# Altium schematic sheet power.SchDoc
size A
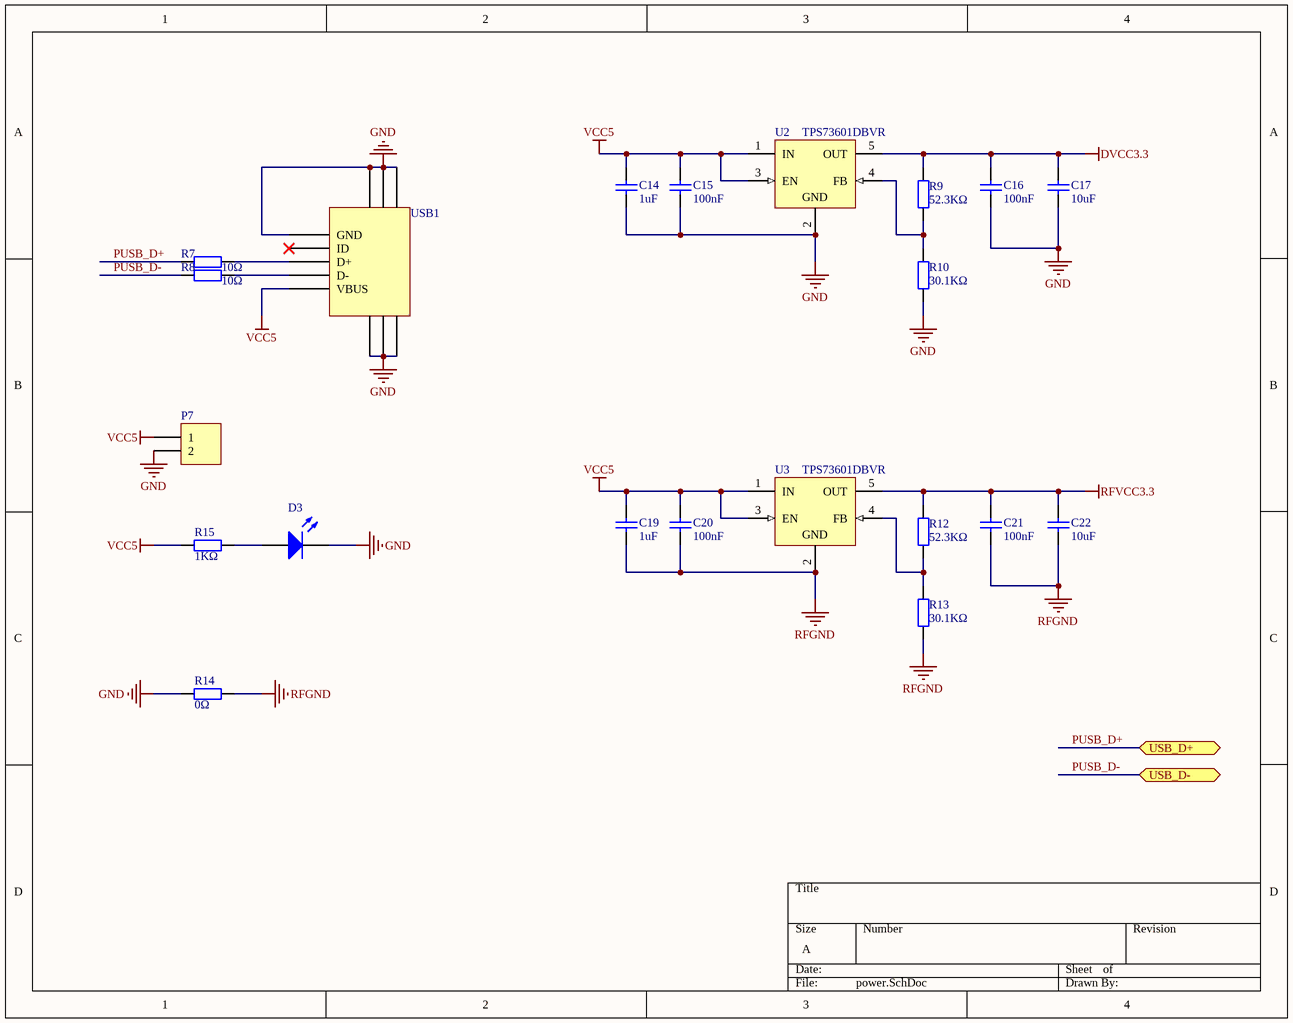
[diagram p0: power.SchDoc]

## Parts
C14  1uF  [0603_C]
C15  100nF  [0603_C]
C16  100nF  [0603_C]
C17  10uF  [0603_C]
C19  1uF  [0603_C]
C20  100nF  [0603_C]
C21  100nF  [0603_C]
C22  10uF  [0603_C]
D3  蓝灯 0805  [0805_LED_S1]  (value not drawn)
P7  Header 2  [HDR1X2]  (value not drawn)
R7  10Ω  [0603_R]
R8  10Ω  [0603_R]
R9  52.3KΩ  [0603_R]
R10  30.1KΩ  [0603_R]
R12  52.3KΩ  [0603_R]
R13  30.1KΩ  [0603_R]
R14  0Ω  [0603_R]
R15  1KΩ  [0603_R]
U2  TPS73601DBVR  [TI-DBV5_L]
U3  TPS73601DBVR  [TI-DBV5_L]
USB1  USB Micro B 1A  [MICRO-USB-1]  (value not drawn)

## Ports
USB_D+ (bidir), USB_D- (bidir)

## Nets
DVCC3.3: C16.2 C17.2 R9.2 U2.5(OUT)
GND: C14.1 C15.1 C16.1 C17.1 D3.K P7.2 R10.1 R14.1 U2.2(GND) USB1.0 USB1.5(GND)
RFGND: C19.1 C20.1 C21.1 C22.1 R13.1 R14.2 U3.2(GND)
RFVCC3.3: C21.2 C22.2 R12.2 U3.5(OUT)
VCC5: C14.2 C15.2 C19.2 C20.2 P7.1 R15.1 U2.1(IN) U2.3(EN) U3.1(IN) U3.3(EN) USB1.1(VBUS)
PUSB_D+: R7.1 ; port USB_D+
PUSB_D-: R8.1 ; port USB_D-
NetD3_A: D3.A R15.2
NetR7_2: R7.2 USB1.3(D+)
NetR8_2: R8.2 USB1.2(D-)
NetR9_1: R9.1 R10.2 U2.4(FB)
NetR12_1: R12.1 R13.2 U3.4(FB)

Not connected (* = marked no-connect by the designer): USB1 4(ID)*

## Library data of the parts
C14 C19 = 0603 1uF (105) 10% 50V: 贴片电容; ComponentLink1Description: 供应商链接; ComponentLink1URL: http://www.szlcsc.com/product/details_16531.html; Package: 0603; Supplier: LC; SuppliersPartNumber: C15849
C15 C16 C20 C21 = 0603 100nF (104) 10% 50V: 贴片电容; ComponentLink1Description: 供应商链接; ComponentLink1URL: http://www.szlcsc.com/product/details_15331.html; Package: 0603; Supplier: LC; SuppliersPartNumber: C14663
C17 C22 = 0603 10uF (106) 10% 10V: 贴片电容; ComponentLink1Description: 供应商链接; ComponentLink1URL: http://www.szlcsc.com/product/details_20411.html; Package: 0603; Supplier: LC; SuppliersPartNumber: C19702
D3 = 0805 蓝灯: 发光二极管; ComponentLink1Description: 供应商链接; ComponentLink1URL: http://www.szlcsc.com/product/details_2666.html; Package: 0805; Supplier: LC; SuppliersPartNumber: C2293
P7 = Header 2: Header, 2-Pin; LatestRevisionDate: 17-Jul-2002; LatestRevisionNote: Re-released for DXP Platform.; Publisher: Altium Limited
R7 R8 = 0603 10Ω (10R0) 1%: 贴片电阻; ComponentLink1Description: 供应商链接; ComponentLink1URL: http://www.szlcsc.com/product/details_23586.html; Package: 0603; Supplier: LC; SuppliersPartNumber: C22859
R9 R12 = 0603 51KΩ (5102) 1%: 贴片电阻; ComponentLink1Description: 供应商链接; ComponentLink1URL: http://www.szlcsc.com/product/details_23923.html; Package: 0603; Supplier: LC; SuppliersPartNumber: C23196
R10 R13 = 0603 30KΩ (3002) 1%: 贴片电阻; ComponentLink1Description: 供应商链接; ComponentLink1URL: http://www.szlcsc.com/product/details_23711.html; Package: 0603; Supplier: LC; SuppliersPartNumber: C22984
R14 = 0603 0Ω (0R0) 1%: 贴片电阻; ComponentLink1Description: 供应商链接; ComponentLink1URL: http://www.szlcsc.com/product/details_21903.html; Package: 0603; Supplier: LC; SuppliersPartNumber: C21189
R15 = 0603 1KΩ (1001) 1%: 贴片电阻; ComponentLink1Description: 供应商链接; ComponentLink1URL: http://www.szlcsc.com/product/details_21904.html; Package: 0603; Supplier: LC; SuppliersPartNumber: C21190
U2 U3 = TPS73601DBVR: Single Output Low Noise LDO, 400 mA, Adjustable 1.2 to 5.5 V Output, 1.7 to 5.5 V Input, with Reverse Current Protection, 5-pin SOT-23 (DBV), -40 to 85 degC, Green (RoHS & no Sb/Br); Manufacturer: Texas Instruments; Accuracy(%): 1; Iout(Max)(A): 0.4; Iq(Typ)(mA): 0.3; Rating: Catalog; SubFamily: Single Channel LDO; Vdo(Typ)(mV): 75; Vin(Max)(V): 5.5; Vin(Min)(V): 1.7; Vout Adj(Min)(V): 1.2; DatasheetVersion: SBVS038T; PackageVersion: 4073253-4/K; PackageReference: DBV5; PackageDescription: 5-Pin Plastic Small Outline, Body 1.60 脳 2.90 mm, Pitch 0.95 mm; Supplier 1: Digi-Key; Supplier Part Number 1: 296-18255-2-ND; Supplier 2: Digi-Key; Supplier Part Number 2: 296-18255-1-ND; Supplier 3: Digi-Key; Supplier Part Number 3: 296-18255-6-ND; Supplier 4: Farnell; Supplier Part Number 4: 1576489; Supplier 5: Newark; Supplier Part Number 5: 87H2971; Supplier 6: Mouser; Supplier Part Number 6: 595-TPS73601DBVR; Eco-Plan: Green (RoHS & no Sb/Br); Vout Adj(Max)(V): 5.5; Mounting Technology: Surface Mount; Code_JEDEC: MO-178; PartNumber: TPS73601DBVR; ComponentLink1Description: Manufacturer URL; ComponentLink1URL: http://www.ti.com/; ComponentLink2Description: Datasheet; ComponentLink2URL: http://www.ti.com/general/docs/lit/getliterature.tsp?genericPartNumber=TPS73601&fileType=pdf; ComponentLink3Description: Package Specification; ComponentLink3URL: http://www.ti.com/litv/pdf/mpds018i; ComponentLink4Description: URL Link1; ComponentLink4URL: Samples URL:http://www.ti.com/product/tps73601#samples
USB1 = MICRO 5PFemaleBtype: ComponentLink1Description: Link; ComponentLink1URL: https://item.szlcsc.com/10961.html